# EAGLE design GB-classic-Link-connector-debug (EAGLE 9.5.2)
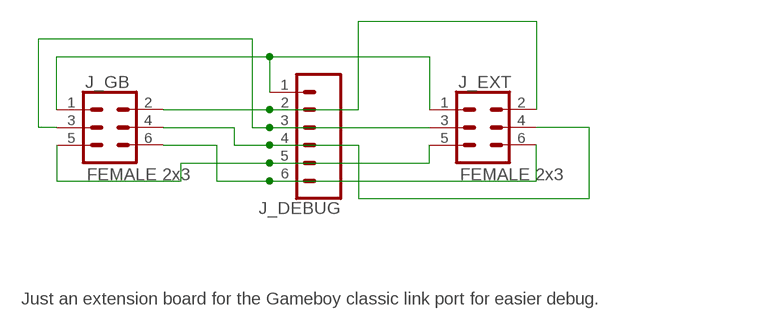
[diagram p0: schematic, sheet 1]

## Parts
J_DEBUG  CONN_06LONGPADS  [1X06_LONGPADS]
J_EXT  FEMALE 2x3  CONN_03X2FEMALE  [2X3]
J_GB  FEMALE 2x3  CONN_03X2FEMALE  [2X3]

## Nets
N$1: J_DEBUG.1 J_EXT.1 J_GB.1
N$2: J_DEBUG.2 J_EXT.2 J_GB.2
N$3: J_DEBUG.3 J_EXT.3 J_GB.3
N$4: J_DEBUG.4 J_EXT.4 J_GB.4
N$5: J_DEBUG.5 J_EXT.5 J_GB.5
N$6: J_DEBUG.6 J_EXT.6 J_GB.6

## Notes on the sheet
- Just an extension board for the Gameboy classic link port for easier debug.

## Library data of the parts
J_DEBUG = SparkFun-Connectors:CONN_06: Multi connection point. Often used as Generic Header-pin footprint for 0.1 inch spaced/style header connections On any of the 0.1 inch spaced packages, you can populate with these: Break Away Headers - Straight <https://www.sparkfun.com/products/116> (PRT-00116) Break Away Male Headers - Right Angle <https://www.sparkfun.com/products/553> (PRT-00553) Female Headers <https://www.sparkfun.com/products/115> (PRT-00115) Break Away Headers - Machine Pin <https://www.sparkfun.com/products/117> (PRT-00117) Break Away Female Headers - Swiss Machine Pin <https://www.sparkfun.com/products/743> (PRT-00743) Arduino Stackable Header - 6 Pin <https://www.sparkfun.com/products/9280> (PRT-09280) Screw Terminals 2.54mm Pitch (6-Pin) <https://www.sparkfun.com/products/16499> (PRT-16499) For SCREWTERMINALS and SPRING TERMINALS visit here: Screw Terimnals on SparkFun.com <https://www.sparkfun.com/search/results?term=Screw+Terminals> (5mm/3.5mm/2.54mm spacing) This device is also useful as a general connection point to wire up your design to another part of your project. Our various solder wires solder well into these plated through hole pads. Hook-Up Wire - Assortment (Stranded, 22 AWG) <https://www.sparkfun.com/products/11375> (PRT-11375) Hook-Up Wire - Assortment (Solid Core, 22 AWG) <https://www.sparkfun.com/products/11367> (PRT-11367) View the entire wire category on our website here <https://www.sparkfun.com/categories/141>
J_EXT J_GB = SparkFun-Connectors:CONN_03X2: Multi connection point. Often used as Generic Header-pin footprint for 0.1 inch spaced/style header connections You can populate with any combo of single row headers, but if you'd like an exact match, check these: Header - 2x3 (Male, 0.1") <https://www.sparkfun.com/products/12807> (PRT-12807) Header - 2x3 (Female, 0.1") <https://www.sparkfun.com/products/13010> (PRT-13010) 2x3 Pin Shrouded Header <https://www.sparkfun.com/products/10877> (PRT-10877) On any of the 0.1 inch spaced packages, you can populate with these: Break Away Headers - Straight <https://www.sparkfun.com/products/116> (PRT-00116) Break Away Male Headers - Right Angle <https://www.sparkfun.com/products/553> (PRT-00553) Female Headers <https://www.sparkfun.com/products/115> (PRT-00115) Break Away Headers - Machine Pin <https://www.sparkfun.com/products/117> (PRT-00117) Break Away Female Headers - Swiss Machine Pin <https://www.sparkfun.com/products/743> (PRT-00743) Special note: the shrouded connector mates well with our 3x2 ribbon cables: Ribbon Crimp Connector - 6-pin (2x3, Female) <https://www.sparkfun.com/products/10651> (PRT-10651) Ribbon Cable - 6 wire (15ft) <https://www.sparkfun.com/products/10646> (PRT-10646); PROD_ID: CONN-11566

## Board
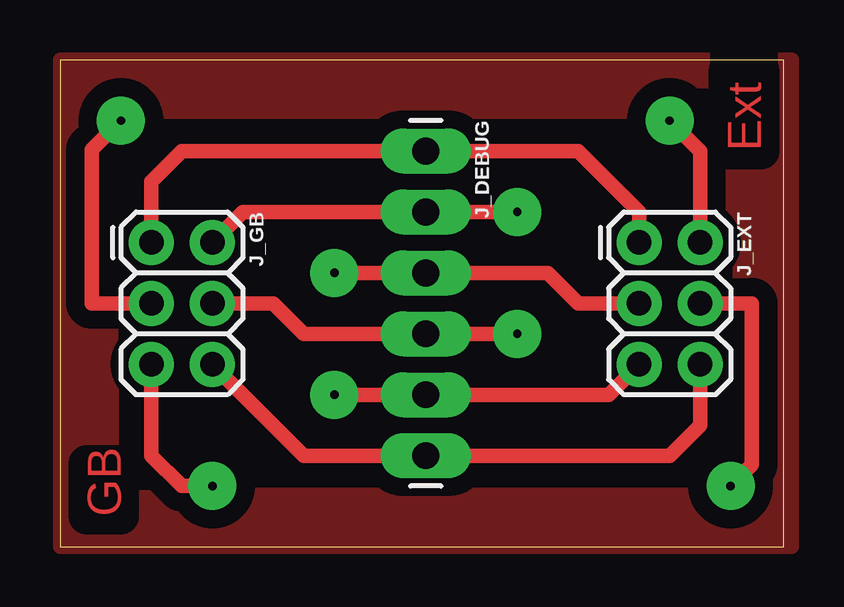
[diagram p1: board, top side]
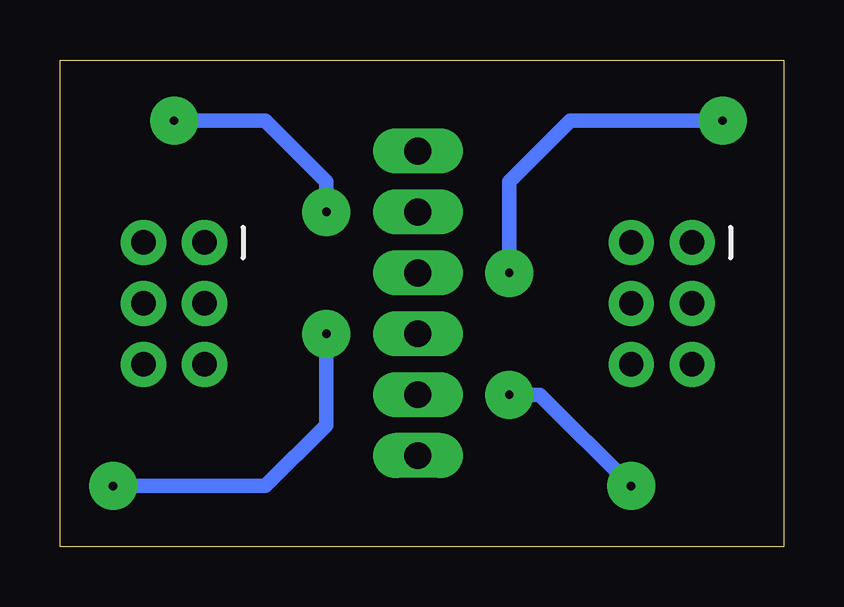
[diagram p2: board, bottom side, seen from below]

Size 30.15 x 20.31 mm. Coordinates in mm from the lower left corner, seen from the top.
Outline: 0,0 30.15,0 30.15,20.31 0,20.31 0,0
Copper layers (1*16): Top 0.035mm / dielectric 1.5mm / Bottom 0.035mm
Design rules "homemade-clearance20 *": minimum track width 0.4mm, minimum drill 0.35mm, track to track 30mil, track to pad 30mil, pad to pad 6mil, via to via 6mil, smd to smd 6mil, copper to edge 0mil, drill to drill 6mil, minimum pad ring 10mil, minimum via ring 8mil, stop-mask expansion 4mil, vias tented up to drill 0mil, thermal gap 10mil

### Footprints (pad centres in the part's own frame; a part is rotated, then mirrored left to right if it is on the bottom)
1X06_LONGPADS = drill 1.118 pad 1.88 long: 1 0,0; 2 2.54,0; 3 5.08,0; 4 7.62,0; 5 10.16,0; 6 12.7,0
2X3 = drill 1.016 pad 1.88: 1 0,0; 2 0,2.54; 3 2.54,0; 4 2.54,2.54; 5 5.08,0; 6 5.08,2.54

### Placement (x,y rotation side)
J_DEBUG  15.24,16.51 270 top
J_EXT  24.13,12.7 270 top
J_GB  3.81,12.7 270 top

### Tracks (layer width: path | path; a pad name or v marks a point on that pad's centre or on a via)
GND
  pour Top: 0,20.32 30.48,20.32 30.48,0 0,0
  cutout Top: 2.54,17.78 26.67,17.78 26.67,2.54 2.54,2.54
N$1
  Top 0.61: J_GB.1 3.81,15.24 5.08,16.51 J_DEBUG.1 21.59,16.51 24.13,13.97 J_EXT.1
N$2  (via drill 0.35 pad 2)
  Top 0.61: J_GB.2 7.62,13.97 J_DEBUG.2 v19.05,13.97 | J_EXT.2 26.67,16.51 v25.4,17.78
  Bottom 0.61: v25.4,17.78 21.59,17.78 19.05,15.24 v19.05,13.97
N$3  (via drill 0.35 pad 2)
  Top 0.61: J_EXT.3 21.59,10.16 20.32,11.43 J_DEBUG.3 v11.43,11.43 | J_GB.3 1.32,10.16 1.32,16.56 v2.54,17.78
  Bottom 0.61: v2.54,17.78 8.89,17.78 11.43,15.24 v11.43,11.43
N$4  (via drill 0.35 pad 2)
  Top 0.61: J_GB.4 8.89,10.16 10.16,8.89 J_DEBUG.4 v19.05,8.89 | J_EXT.4 28.83,10.16 28.83,3.43 v27.94,2.54
  Bottom 0.61: v27.94,2.54 21.59,2.54 19.05,5.08 v19.05,8.89
N$5  (via drill 0.35 pad 2)
  Top 0.61: J_EXT.5 22.86,6.35 J_DEBUG.5 v11.43,6.35 | J_GB.5 3.81,3.81 5.08,2.54 v6.35,2.54
  Bottom 0.61: v6.35,2.54 10.16,6.35 v11.43,6.35
N$6
  Top 0.61: J_GB.6 10.16,3.81 J_DEBUG.6 25.4,3.81 26.67,5.08 J_EXT.6

### Text on the board
Top: Ext | GB